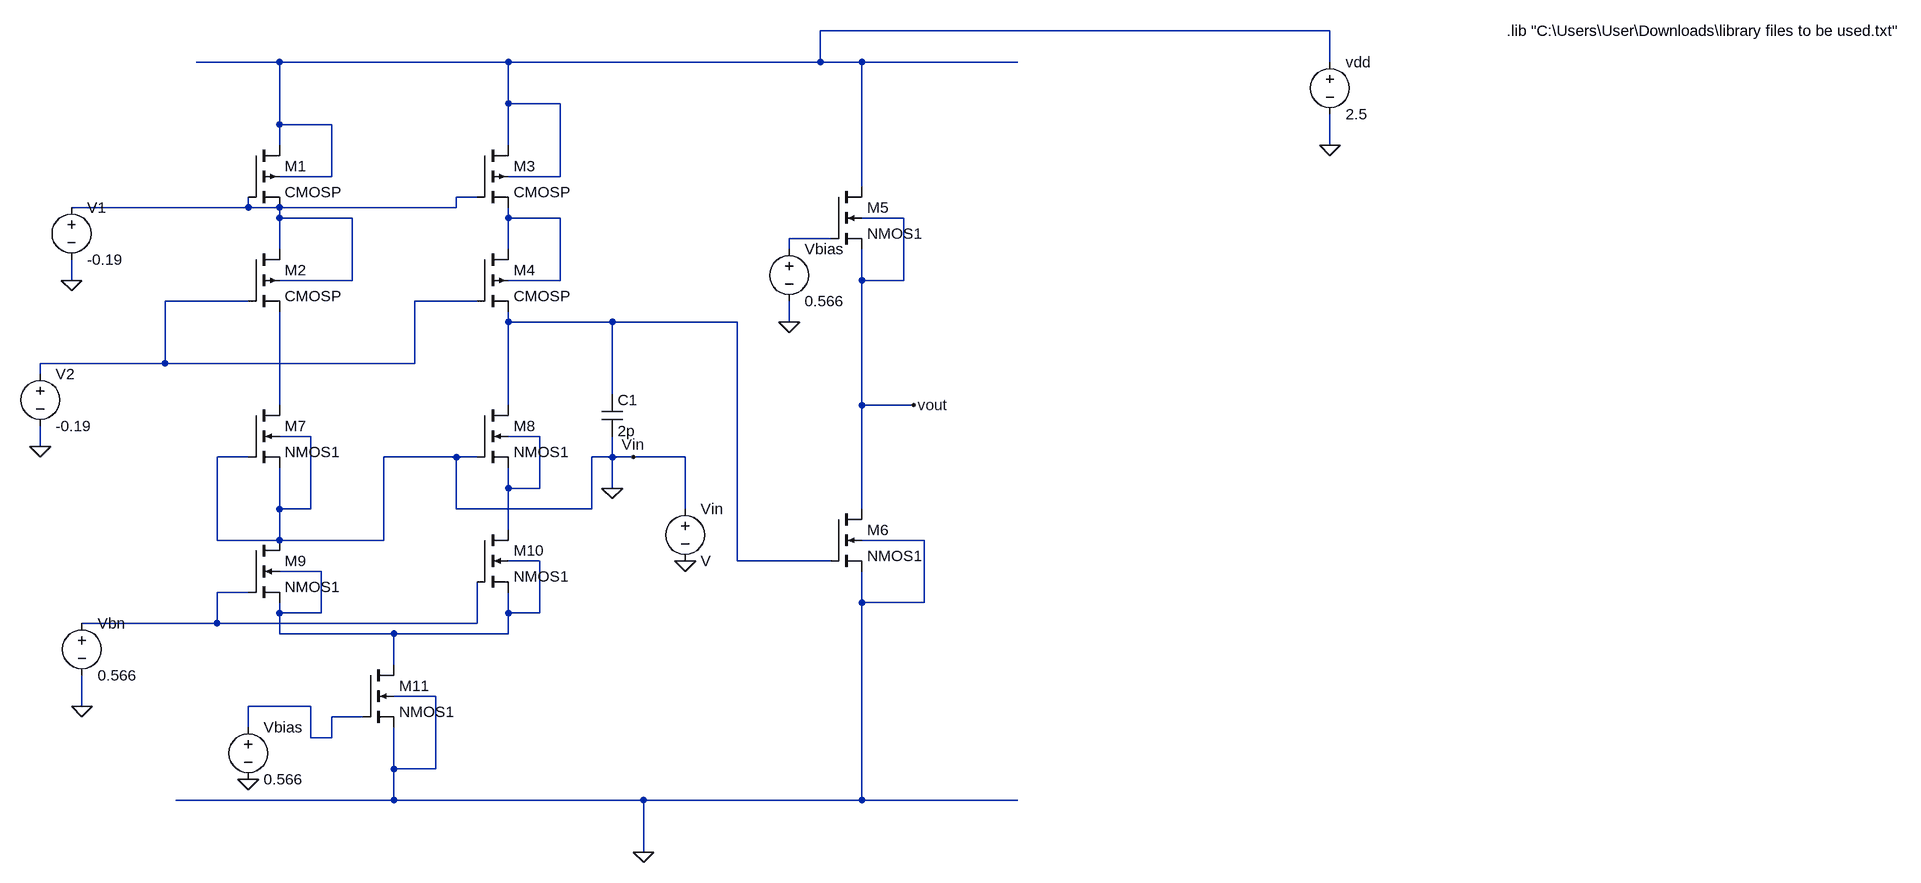
[diagram p0: schematic question_1.asc]
question_1.asc, the LTspice schematic file:
Version 4.1
SHEET 1 1780 1076
WIRE 816 -208 32 -208
WIRE -800 -160 -928 -160
WIRE -448 -160 -800 -160
WIRE 32 -160 32 -208
WIRE 32 -160 -448 -160
WIRE 96 -160 32 -160
WIRE 336 -160 96 -160
WIRE 816 -160 816 -208
WIRE -448 -96 -448 -160
WIRE -368 -96 -448 -96
WIRE -800 -64 -800 -160
WIRE -720 -64 -800 -64
WIRE -800 -32 -800 -64
WIRE -448 -32 -448 -96
WIRE 816 -32 816 -80
WIRE -720 16 -720 -64
WIRE -720 16 -800 16
WIRE -368 16 -368 -96
WIRE -368 16 -448 16
WIRE 96 32 96 -160
WIRE -496 48 -528 48
WIRE -848 64 -848 48
WIRE -848 64 -1120 64
WIRE -800 64 -848 64
WIRE -528 64 -528 48
WIRE -528 64 -800 64
WIRE -800 80 -800 64
WIRE -688 80 -800 80
WIRE -448 80 -448 64
WIRE -368 80 -448 80
WIRE 160 80 96 80
WIRE 48 112 -16 112
WIRE -800 128 -800 80
WIRE -448 128 -448 80
WIRE -16 128 -16 112
WIRE -1120 176 -1120 144
WIRE -688 176 -688 80
WIRE -688 176 -800 176
WIRE -368 176 -368 80
WIRE -368 176 -448 176
WIRE 96 176 96 128
WIRE 160 176 160 80
WIRE 160 176 96 176
WIRE -848 208 -976 208
WIRE -496 208 -592 208
WIRE -448 240 -448 224
WIRE -288 240 -448 240
WIRE -96 240 -288 240
WIRE -16 240 -16 208
WIRE -976 304 -976 208
WIRE -976 304 -1168 304
WIRE -592 304 -592 208
WIRE -592 304 -976 304
WIRE -1168 320 -1168 304
WIRE -288 352 -288 240
WIRE -800 368 -800 224
WIRE -448 368 -448 240
WIRE 96 368 96 176
WIRE 176 368 96 368
WIRE -752 416 -800 416
WIRE -400 416 -448 416
WIRE -1168 432 -1168 400
WIRE -848 448 -896 448
WIRE -528 448 -640 448
WIRE -496 448 -528 448
WIRE -288 448 -288 416
WIRE -288 448 -320 448
WIRE -256 448 -288 448
WIRE -176 448 -256 448
WIRE -448 496 -448 464
WIRE -400 496 -400 416
WIRE -400 496 -448 496
WIRE -288 496 -288 448
WIRE -800 528 -800 464
WIRE -752 528 -752 416
WIRE -752 528 -800 528
WIRE -528 528 -528 448
WIRE -320 528 -320 448
WIRE -320 528 -528 528
WIRE -176 528 -176 448
WIRE 96 528 96 368
WIRE -448 560 -448 496
WIRE -896 576 -896 448
WIRE -800 576 -800 528
WIRE -800 576 -896 576
WIRE -640 576 -640 448
WIRE -640 576 -800 576
WIRE 192 576 96 576
WIRE -400 608 -448 608
WIRE -96 608 -96 240
WIRE 48 608 -96 608
WIRE -736 624 -800 624
WIRE -848 656 -896 656
WIRE 96 672 96 624
WIRE 192 672 192 576
WIRE 192 672 96 672
WIRE -800 688 -800 672
WIRE -736 688 -736 624
WIRE -736 688 -800 688
WIRE -448 688 -448 656
WIRE -400 688 -400 608
WIRE -400 688 -448 688
WIRE -896 704 -896 656
WIRE -896 704 -1104 704
WIRE -496 704 -496 640
WIRE -496 704 -896 704
WIRE -800 720 -800 688
WIRE -624 720 -800 720
WIRE -448 720 -448 688
WIRE -448 720 -624 720
WIRE -624 768 -624 720
WIRE -560 816 -624 816
WIRE -1104 832 -1104 784
WIRE -752 832 -848 832
WIRE -672 848 -720 848
WIRE -848 864 -848 832
WIRE -752 880 -752 832
WIRE -720 880 -720 848
WIRE -720 880 -752 880
WIRE -624 928 -624 864
WIRE -560 928 -560 816
WIRE -560 928 -624 928
WIRE -624 976 -624 928
WIRE -624 976 -960 976
WIRE -240 976 -624 976
WIRE 96 976 96 672
WIRE 96 976 -240 976
WIRE 336 976 96 976
WIRE -240 1056 -240 976
FLAG -240 1056 0
FLAG 816 -32 0
FLAG -288 496 0
FLAG -848 944 0
FLAG 176 368 vout
FLAG -176 608 0
FLAG -256 448 Vin
FLAG -1104 832 0
FLAG -1168 432 0
FLAG -1120 176 0
FLAG -16 240 0
SYMBOL voltage 816 -176 R0
SYMATTR InstName vdd
SYMATTR Value 2.5
SYMBOL pmos4 -848 -32 R0
SYMATTR InstName M1
SYMATTR Value CMOSP
SYMBOL pmos4 -848 128 R0
SYMATTR InstName M2
SYMATTR Value CMOSP
SYMBOL pmos4 -496 -32 R0
SYMATTR InstName M3
SYMATTR Value CMOSP
SYMBOL pmos4 -496 128 R0
SYMATTR InstName M4
SYMATTR Value CMOSP
SYMBOL nmos4 48 32 R0
SYMATTR InstName M5
SYMATTR Value NMOS1
SYMBOL nmos4 48 528 R0
SYMATTR InstName M6
SYMATTR Value NMOS1
SYMBOL nmos4 -848 368 R0
SYMATTR InstName M7
SYMATTR Value NMOS1
SYMBOL nmos4 -496 368 R0
SYMATTR InstName M8
SYMATTR Value NMOS1
SYMBOL nmos4 -848 576 R0
SYMATTR InstName M9
SYMATTR Value NMOS1
SYMBOL nmos4 -496 560 R0
SYMATTR InstName M10
SYMATTR Value NMOS1
SYMBOL nmos4 -672 768 R0
SYMATTR InstName M11
SYMATTR Value NMOS1
SYMBOL cap -304 352 R0
SYMATTR InstName C1
SYMATTR Value 2p
SYMBOL voltage -848 848 R0
SYMATTR InstName Vbias
SYMATTR Value 0.566
SYMBOL voltage -176 512 R0
SYMATTR InstName Vin
SYMBOL voltage -1120 48 R0
SYMATTR InstName V1
SYMATTR Value -0.19
SYMBOL voltage -1168 304 R0
SYMATTR InstName V2
SYMATTR Value -0.19
SYMBOL voltage -1104 688 R0
SYMATTR InstName Vbn
SYMATTR Value 0.566
SYMBOL voltage -16 112 R0
WINDOW 123 0 0 Left 0
WINDOW 39 0 0 Left 0
SYMATTR InstName Vbias
SYMATTR Value 0.566
TEXT 1088 -208 Left 2 !.lib "C:\\Users\\User\\Downloads\\library files to be used.txt"

The netlist it stands for:
* question_1.asc
vdd N001 0 2.5
M1 N001 N002 N002 N001 CMOSP
M2 N002 N005 N007 N002 CMOSP
M3 N001 N002 N003 N001 CMOSP
M4 N003 N005 N006 N003 CMOSP
M5 N001 N004 vout vout NMOS1
M6 vout N006 0 0 NMOS1
M7 N007 0 0 0 NMOS1
M8 N006 0 N008 N008 NMOS1
M9 0 N010 N009 N009 NMOS1
M10 N008 N010 N009 N009 NMOS1
M11 N009 N011 0 0 NMOS1
C1 N006 0 2p
Vbias N011 0 0.566
Vin 0 0 V
V1 N002 0 -0.19
V2 N005 0 -0.19
Vbn N010 0 0.566
Vbias N004 0 0.566
.model NMOS NMOS
.model PMOS PMOS
.lib standard.mos
.lib "C:\Users\User\Downloads\library files to be used.txt"
.backanno
.end